# Altium schematic sheet 3.UART.SchDoc
size A2
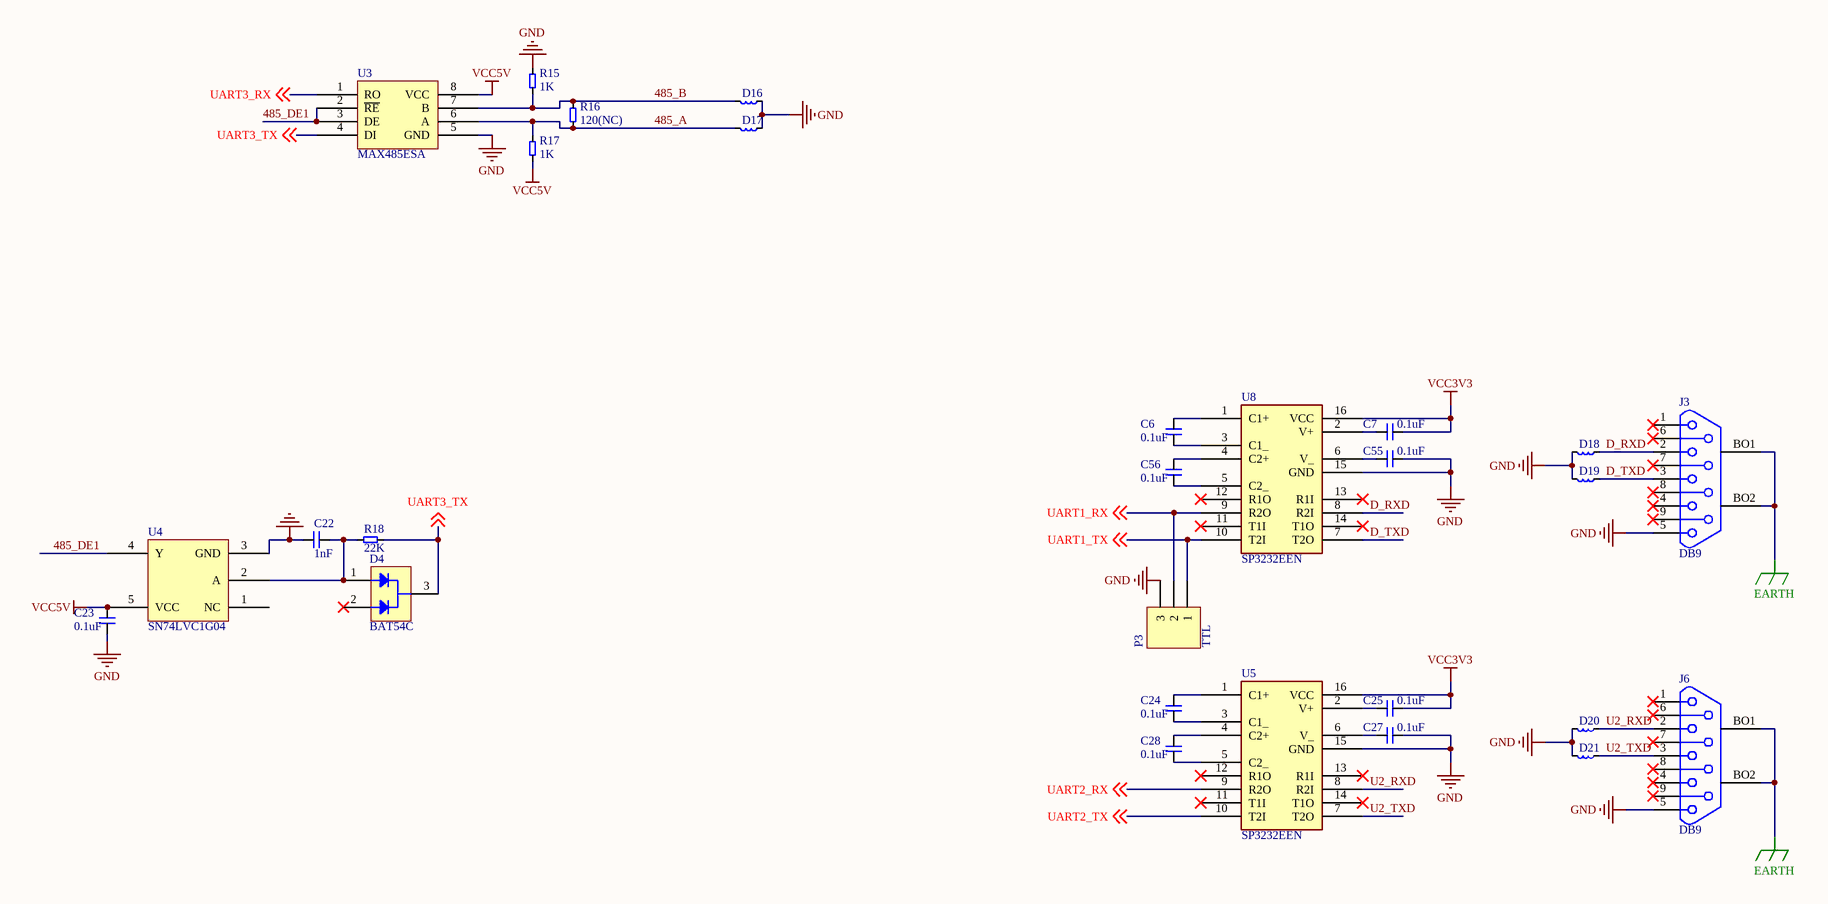
[diagram p0: 3.UART.SchDoc]

## Parts
C6  0.1uF  [0603C]
C7  0.1uF  [0603C]
C22  1nF  [0603C]
C23  0.1uF  [0603C]
C24  0.1uF  [0603C]
C25  0.1uF  [0603C]
C27  0.1uF  [0603C]
C28  0.1uF  [0603C]
C55  0.1uF  [0603C]
C56  0.1uF  [0603C]
D4  BAT54C  [SOT-23]
D16  ESD  [0603L]  (value not drawn)
D17  ESD  [0603L]  (value not drawn)
D18  ESD  [0603L]  (value not drawn)
D19  ESD  [0603L]  (value not drawn)
D20  ESD  [0603L]  (value not drawn)
D21  ESD  [0603L]  (value not drawn)
J3  DB9  [DB-9/M]
J6  DB9  [DB-9/M]
P3  TTL  [HY2.0-3P]
R15  1K  [0603R]
R16  120(NC)  [0603R]
R17  1K  [0603R]
R18  22K  [0603R]
U3  MAX485ESA  [SOP8-1.27]
U4  SN74LVC1G04  [SOT23-5N]
U5  SP3232EEN  [SOIC16-1.27]
U8  SP3232EEN  [SOIC16-1.27]

## Nets
EARTH: J3.BO1 J3.BO2 J6.BO1 J6.BO2 P3.0(9)
GND: C22.1 C23.2 C27.2 C55.2 D16.1 D17.1 D18.2 D19.2 D20.2 D21.2 J3.5 J6.5 P3.3 R15.2 U3.5(GND) U4.3(GND) U5.15(GND) U8.15(GND)
VCC3V3: C7.2 C25.2 U5.16(VCC) U8.16(VCC)
VCC5V: C23.1 R17.1 U3.8(VCC) U4.5(VCC)
485_A: D17.2 R16.1 R17.2 U3.6(A)
485_B: D16.2 R15.1 R16.2 U3.7(B)
485_DE1: U3.2(~{RE}) U3.3(DE) U4.4(Y)
D_RXD: D18.1 J3.2 U8.8(R2I)
D_TXD: D19.1 J3.3 U8.7(T2O)
U2_RXD: D20.1 J6.2 U5.8(R2I)
U2_TXD: D21.1 J6.3 U5.7(T2O)
UART1_RX: P3.2 U8.9(R2O) ; off-sheet UART1_RX
UART1_TX: P3.1 U8.10(T2I) ; off-sheet UART1_TX
UART2_RX: U5.9(R2O) ; off-sheet UART2_RX
UART2_TX: U5.10(T2I) ; off-sheet UART2_TX
UART3_RX: U3.1(RO) ; off-sheet UART3_RX
UART3_TX: D4.3 R18.2 U3.4(DI) ; off-sheet UART3_TX
NetC6_1: C6.1 U8.1(C1+)
NetC6_2: C6.2 U8.3(C1_)
NetC7_1: C7.1 U8.2(V+)
NetC22_2: C22.2 D4.1 R18.1 U4.2(A)
NetC24_1: C24.1 U5.1(C1+)
NetC24_2: C24.2 U5.3(C1_)
NetC25_1: C25.1 U5.2(V+)
NetC27_1: C27.1 U5.6(V_)
NetC28_1: C28.1 U5.4(C2+)
NetC28_2: C28.2 U5.5(C2_)
NetC55_1: C55.1 U8.6(V_)
NetC56_1: C56.1 U8.4(C2+)
NetC56_2: C56.2 U8.5(C2_)

Not connected (* = marked no-connect by the designer): D4 2*; J3 1* 4* 6* 7* 8* 9*; J6 1* 4* 6* 7* 8* 9*; U4 1(NC); U5 11(T1I)* 12(R1O)* 13(R1I)* 14(T1O)*; U8 11(T1I)* 12(R1O)* 13(R1I)* 14(T1O)*

## Library data of the parts
C6 C7 C22-C25 C27 C28 C55 C56 = 电容
D4 = BAT54C: SCHOTTKY DIODE
D16-D21 = 电感
P3 = Header 3: Header, 3-Pin; LatestRevisionDate: 17-Jul-2002; LatestRevisionNote: Re-released for DXP Platform.; Publisher: Altium Limited
R15-R18 = 电阻
U5 U8 = MAX232ESE: Text Field1: MAXIM; Text Field2: RS232; MAXIM: *
U3 = MAX485ESA: MAXIM: *